# Altium schematic sheet MT8365_Ground.SchDoc
size A3; SheetNumber: 10; SheetTotal: 36
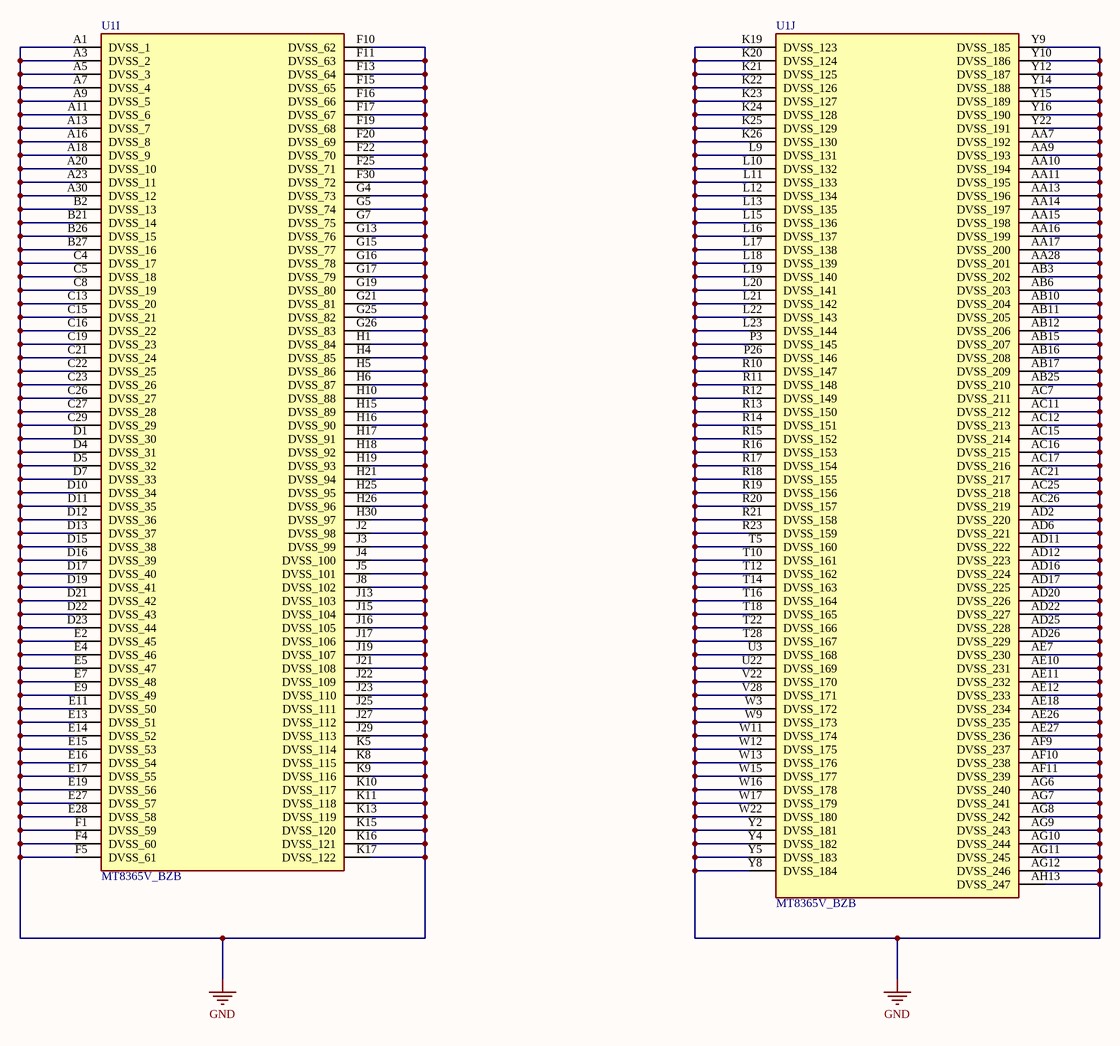
[diagram p0: MT8365_Ground.SchDoc]

## Parts
U1  MT8365V_BZB  [BGA633C40P30X29_1220X1180X90]  (parts I,J of 10)

## Nets
GND: U1.A1(DVSS_1) U1.A3(DVSS_2) U1.A5(DVSS_3) U1.A7(DVSS_4) U1.A9(DVSS_5) U1.A11(DVSS_6) U1.A13(DVSS_7) U1.A16(DVSS_8) U1.A18(DVSS_9) U1.A20(DVSS_10) U1.A23(DVSS_11) U1.A30(DVSS_12) U1.AA7(DVSS_192) U1.AA9(DVSS_193) U1.AA10(DVSS_194) U1.AA11(DVSS_195) U1.AA13(DVSS_196) U1.AA14(DVSS_197) U1.AA15(DVSS_198) U1.AA16(DVSS_199) U1.AA17(DVSS_200) U1.AA28(DVSS_201) U1.AB3(DVSS_202) U1.AB6(DVSS_203) U1.AB10(DVSS_204) U1.AB11(DVSS_205) U1.AB12(DVSS_206) U1.AB15(DVSS_207) U1.AB16(DVSS_208) U1.AB17(DVSS_209) U1.AB25(DVSS_210) U1.AC7(DVSS_211) U1.AC11(DVSS_212) U1.AC12(DVSS_213) U1.AC15(DVSS_214) U1.AC16(DVSS_215) U1.AC17(DVSS_216) U1.AC21(DVSS_217) U1.AC25(DVSS_218) U1.AC26(DVSS_219) U1.AD2(DVSS_220) U1.AD6(DVSS_221) U1.AD11(DVSS_222) U1.AD12(DVSS_223) U1.AD16(DVSS_224) U1.AD17(DVSS_225) U1.AD20(DVSS_226) U1.AD22(DVSS_227) U1.AD25(DVSS_228) U1.AD26(DVSS_229) U1.AE7(DVSS_230) U1.AE10(DVSS_231) U1.AE11(DVSS_232) U1.AE12(DVSS_233) U1.AE18(DVSS_234) U1.AE26(DVSS_235) U1.AE27(DVSS_236) U1.AF9(DVSS_237) U1.AF10(DVSS_238) U1.AF11(DVSS_239) U1.AG6(DVSS_240) U1.AG7(DVSS_241) U1.AG8(DVSS_242) U1.AG9(DVSS_243) U1.AG10(DVSS_244) U1.AG11(DVSS_245) U1.AG12(DVSS_246) U1.AH13(DVSS_247) U1.B2(DVSS_13) U1.B21(DVSS_14) U1.B26(DVSS_15) U1.B27(DVSS_16) U1.C4(DVSS_17) U1.C5(DVSS_18) U1.C8(DVSS_19) U1.C13(DVSS_20) U1.C15(DVSS_21) U1.C16(DVSS_22) U1.C19(DVSS_23) U1.C21(DVSS_24) U1.C22(DVSS_25) U1.C23(DVSS_26) U1.C26(DVSS_27) U1.C27(DVSS_28) U1.C29(DVSS_29) U1.D1(DVSS_30) U1.D4(DVSS_31) U1.D5(DVSS_32) U1.D7(DVSS_33) U1.D10(DVSS_34) U1.D11(DVSS_35) U1.D12(DVSS_36) U1.D13(DVSS_37) U1.D15(DVSS_38) U1.D16(DVSS_39) U1.D17(DVSS_40) U1.D19(DVSS_41) U1.D21(DVSS_42) U1.D22(DVSS_43) U1.D23(DVSS_44) U1.E2(DVSS_45) U1.E4(DVSS_46) U1.E5(DVSS_47) U1.E7(DVSS_48) U1.E9(DVSS_49) U1.E11(DVSS_50) U1.E13(DVSS_51) U1.E14(DVSS_52) U1.E15(DVSS_53) U1.E16(DVSS_54) U1.E17(DVSS_55) U1.E19(DVSS_56) U1.E27(DVSS_57) U1.E28(DVSS_58) U1.F1(DVSS_59) U1.F4(DVSS_60) U1.F5(DVSS_61) U1.F10(DVSS_62) U1.F11(DVSS_63) U1.F13(DVSS_64) U1.F15(DVSS_65) U1.F16(DVSS_66) U1.F17(DVSS_67) U1.F19(DVSS_68) U1.F20(DVSS_69) U1.F22(DVSS_70) U1.F25(DVSS_71) U1.F30(DVSS_72) U1.G4(DVSS_73) U1.G5(DVSS_74) U1.G7(DVSS_75) U1.G13(DVSS_76) U1.G15(DVSS_77) U1.G16(DVSS_78) U1.G17(DVSS_79) U1.G19(DVSS_80) U1.G21(DVSS_81) U1.G25(DVSS_82) U1.G26(DVSS_83) U1.H1(DVSS_84) U1.H4(DVSS_85) U1.H5(DVSS_86) U1.H6(DVSS_87) U1.H10(DVSS_88) U1.H15(DVSS_89) U1.H16(DVSS_90) U1.H17(DVSS_91) U1.H18(DVSS_92) U1.H19(DVSS_93) U1.H21(DVSS_94) U1.H25(DVSS_95) U1.H26(DVSS_96) U1.H30(DVSS_97) U1.J2(DVSS_98) U1.J3(DVSS_99) U1.J4(DVSS_100) U1.J5(DVSS_101) U1.J8(DVSS_102) U1.J13(DVSS_103) U1.J15(DVSS_104) U1.J16(DVSS_105) U1.J17(DVSS_106) U1.J19(DVSS_107) U1.J21(DVSS_108) U1.J22(DVSS_109) U1.J23(DVSS_110) U1.J25(DVSS_111) U1.J27(DVSS_112) U1.J29(DVSS_113) U1.K5(DVSS_114) U1.K8(DVSS_115) U1.K9(DVSS_116) U1.K10(DVSS_117) U1.K11(DVSS_118) U1.K13(DVSS_119) U1.K15(DVSS_120) U1.K16(DVSS_121) U1.K17(DVSS_122) U1.K19(DVSS_123) U1.K20(DVSS_124) U1.K21(DVSS_125) U1.K22(DVSS_126) U1.K23(DVSS_127) U1.K24(DVSS_128) U1.K25(DVSS_129) U1.K26(DVSS_130) U1.L9(DVSS_131) U1.L10(DVSS_132) U1.L11(DVSS_133) U1.L12(DVSS_134) U1.L13(DVSS_135) U1.L15(DVSS_136) U1.L16(DVSS_137) U1.L17(DVSS_138) U1.L18(DVSS_139) U1.L19(DVSS_140) U1.L20(DVSS_141) U1.L21(DVSS_142) U1.L22(DVSS_143) U1.L23(DVSS_144) U1.P3(DVSS_145) U1.P26(DVSS_146) U1.R10(DVSS_147) U1.R11(DVSS_148) U1.R12(DVSS_149) U1.R13(DVSS_150) U1.R14(DVSS_151) U1.R15(DVSS_152) U1.R16(DVSS_153) U1.R17(DVSS_154) U1.R18(DVSS_155) U1.R19(DVSS_156) U1.R20(DVSS_157) U1.R21(DVSS_158) U1.R23(DVSS_159) U1.T5(DVSS_160) U1.T10(DVSS_161) U1.T12(DVSS_162) U1.T14(DVSS_163) U1.T16(DVSS_164) U1.T18(DVSS_165) U1.T22(DVSS_166) U1.T28(DVSS_167) U1.U3(DVSS_168) U1.U22(DVSS_169) U1.V22(DVSS_170) U1.V28(DVSS_171) U1.W3(DVSS_172) U1.W9(DVSS_173) U1.W11(DVSS_174) U1.W12(DVSS_175) U1.W13(DVSS_176) U1.W15(DVSS_177) U1.W16(DVSS_178) U1.W17(DVSS_179) U1.W22(DVSS_180) U1.Y2(DVSS_181) U1.Y4(DVSS_182) U1.Y5(DVSS_183) U1.Y8(DVSS_184) U1.Y9(DVSS_185) U1.Y10(DVSS_186) U1.Y12(DVSS_187) U1.Y14(DVSS_188) U1.Y15(DVSS_189) U1.Y16(DVSS_190) U1.Y22(DVSS_191)

## Library data of the parts
U1 = MT8365V_BZB: SoC; Manufacturer_Name: Mediatek; Manufacturer_Part_Number: MT8365V/BZB; Datasheet Link: https://www.mouser.co.uk/datasheet/2/1074/MT8365_AIoT_Application_Processor_Datasheet_v1_0_2-3106631.pdf; Height: 0.9mm; Mouser Part Number: 840-MT8365V/BZB; Mouser Price/Stock: https://www.mouser.co.uk/ProductDetail/MediaTek/MT8365V-BZB?qs=Jm2GQyTW%2FbjcedX9ugwNWQ%3D%3D